# Altium project VESC_KS75600.PrjPcb
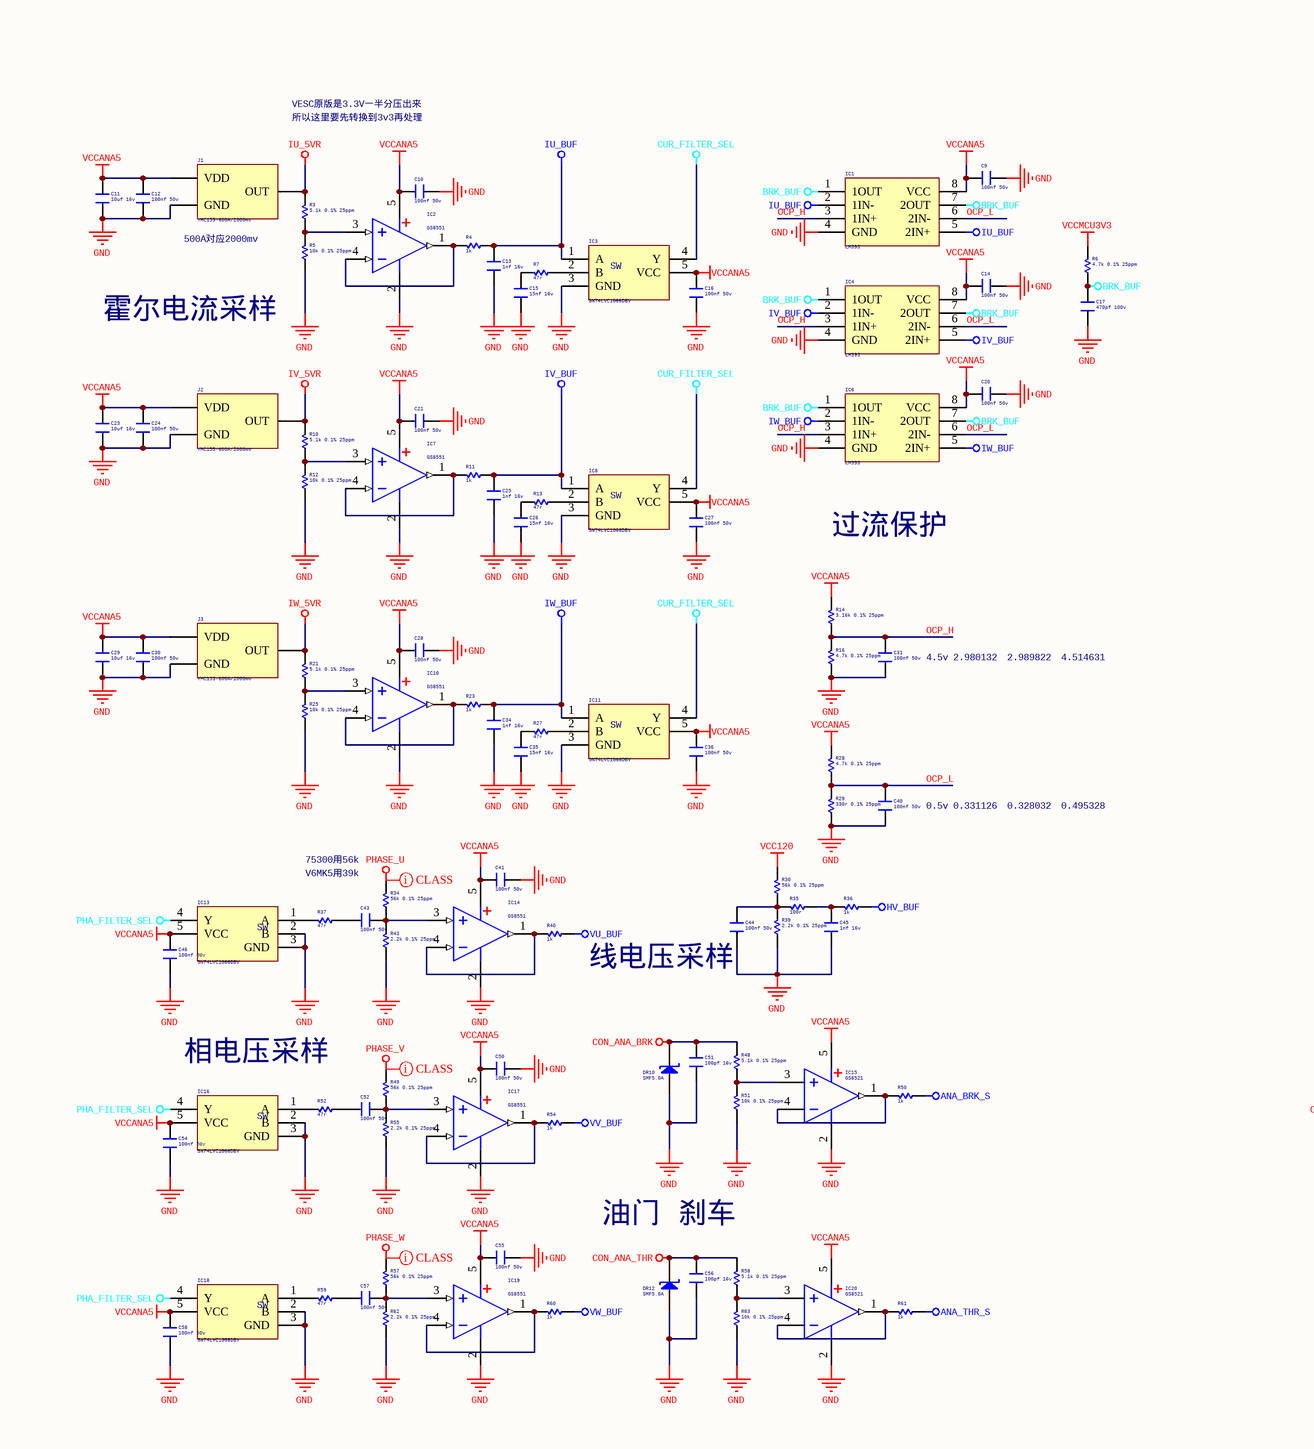
[diagram p0: VESC_KS75600_ana_con.SchDoc, left]
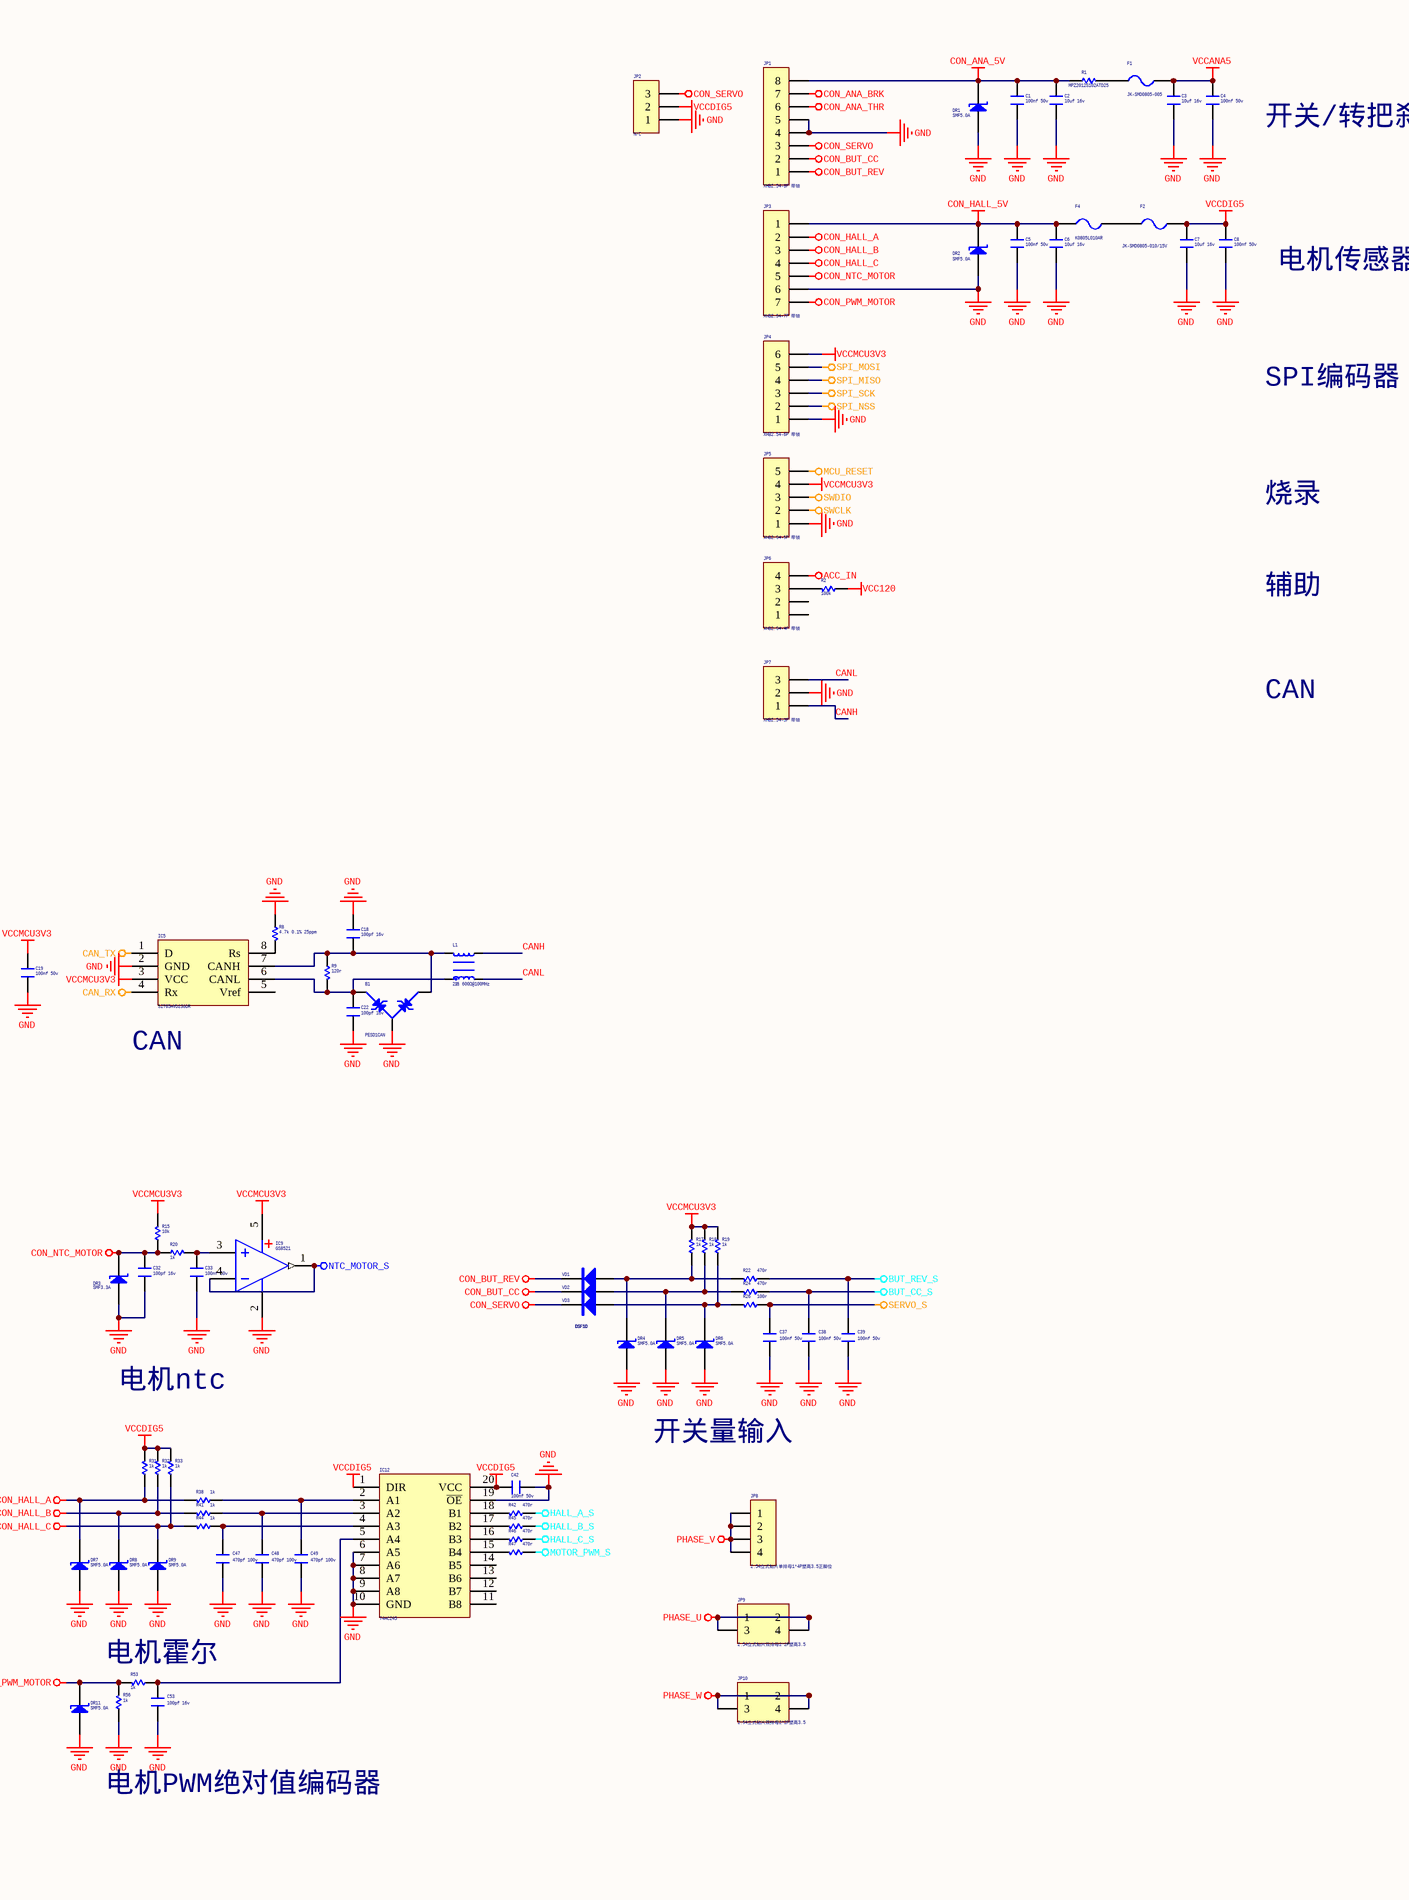
[diagram p1: VESC_KS75600_ana_con.SchDoc, right]
4 sheets, 300 parts. Net scope: global (net labels, ports and power ports of the same name join across sheets).
Board file: VESC_KS75600.PcbDoc
Sheets:
  VESC_KS75600_ana_con.SchDoc
  VESC_KS75600_power.SchDoc
  VESC_KS75600_motor_mcu.SchDoc
  VESC_KS75600_mos_driver_conn.SchDoc

## Sheet VESC_KS75600_ana_con.SchDoc
size A2; SheetNumber: 1; SheetTotal: 4

### Parts
B1  PESD1CAN  [SOT23-3L]
C1  100nf 50v  [C 0603]
C2  10uf 16v  [C 0805]
C3  10uf 16v  [C 0805]
C4  100nf 50v  [C 0603]
C5  100nf 50v  [C 0603]
C6  10uf 16v  [C 0805]
C7  10uf 16v  [C 0805]
C8  100nf 50v  [C 0603]
C9  100nf 50v  [C 0603]
C10  100nf 50v  [C 0603]
C11  10uf 16v  [C 0805]
C12  100nf 50v  [C 0603]
C13  1nf 16v  [C 0603]
C14  100nf 50v  [C 0603]
C15  15nf 16v  [C 0603]
C16  100nf 50v  [C 0603]
C17  470pf 100v  [C 0805]
C18  100pf 16v  [C 0603]
C19  100nf 50v  [C 0603]
C20  100nf 50v  [C 0603]
C21  100nf 50v  [C 0603]
C22  100pf 16v  [C 0603]
C23  10uf 16v  [C 0805]
C24  100nf 50v  [C 0603]
C25  1nf 16v  [C 0603]
C26  15nf 16v  [C 0603]
C27  100nf 50v  [C 0603]
C28  100nf 50v  [C 0603]
C29  10uf 16v  [C 0805]
C30  100nf 50v  [C 0603]
C31  100nf 50v  [C 0603]
C32  100pf 16v  [C 0603]
C33  100nf 50v  [C 0603]
C34  1nf 16v  [C 0603]
C35  15nf 16v  [C 0603]
C36  100nf 50v  [C 0603]
C37  100nf 50v  [C 0805]
C38  100nf 50v  [C 0805]
C39  100nf 50v  [C 0805]
C40  100nf 50v  [C 0603]
C41  100nf 50v  [C 0603]
C42  100nf 50v  [C 0603]
C43  100nf 50v  [C 0805]
C44  100nf 50v  [C 0805]
C45  1nf 16v  [C 0603]
C46  100nf 50v  [C 0603]
C47  470pf 100v  [C 0805]
C48  470pf 100v  [C 0805]
C49  470pf 100v  [C 0805]
C50  100nf 50v  [C 0603]
C51  100pf 16v  [C 0603]
C52  100nf 50v  [C 0805]
C53  100pf 16v  [C 0805]
C54  100nf 50v  [C 0603]
C55  100nf 50v  [C 0603]
C56  100pf 16v  [C 0603]
C57  100nf 50v  [C 0805]
C58  100nf 50v  [C 0603]
DR1  SMF5.0A  [SOD-123F]
DR2  SMF5.0A  [SOD-123F]
DR3  SMF3.3A  [SOD-123F]
DR4  SMF5.0A  [SOD-123F]
DR5  SMF5.0A  [SOD-123F]
DR6  SMF5.0A  [SOD-123F]
DR7  SMF5.0A  [SOD-123F]
DR8  SMF5.0A  [SOD-123F]
DR9  SMF5.0A  [SOD-123F]
DR10  SMF5.0A  [SOD-123F]
DR11  SMF5.0A  [SOD-123F]
DR12  SMF5.0A  [SOD-123F]
F1  JK-SMD0805-005  [FU 0805]
F2  JK-SMD0805-010/15V  [FU 0805]
F4  K0805L010AR  [FU 0805]
IC1  LM393  [SOP8_N]
IC2  GS8551  [SOT23-5L]
IC3  SN74LVC1G66DBV  [SOT23-5N]
IC4  LM393  [SOP8_N]
IC5  SIT65HVD230DR  [SOP8_N]
IC6  LM393  [SOP8_N]
IC7  GS8551  [SOT23-5L]
IC8  SN74LVC1G66DBV  [SOT23-5N]
IC9  GS8521  [SOT23-5N]
IC10  GS8551  [SOT23-5L]
IC11  SN74LVC1G66DBV  [SOT23-5N]
IC12  74HC245  [TSSOP20_N]
IC13  SN74LVC1G66DBV  [SOT23-5N]
IC14  GS8551  [SOT23-5L]
IC15  GS8521  [SOT23-5N]
IC16  SN74LVC1G66DBV  [SOT23-5N]
IC17  GS8551  [SOT23-5L]
IC18  SN74LVC1G66DBV  [SOT23-5N]
IC19  GS8551  [SOT23-5L]
IC20  GS8521  [SOT23-5N]
J1  YMC15S-600A/2000mv  [YMC15S]
J2  YMC15S-600A/2000mv  [YMC15S]
J3  YMC15S-600A/2000mv  [YMC15S]
JP1  XHB2.54-8P 带锁  [XH2.54-8P]
JP2  N/C  [HDR-1X3]
JP3  XHB2.54-7P 带锁  [XH2.54-7P]
JP4  XHB2.54-6P 带锁  [XH2.54-6P]
JP5  XHB2.54-5P 带锁  [XH2.54-5P]
JP6  XHB2.54-4P 带锁  [XH2.54-4P]
JP7  XHB2.54-3P 带锁  [XH2.54-3P]
JP8  2.54立式贴片单排母1*4P塑高3.5正脚位  [2.54立贴错位排母 4P]
JP9  2.54立式贴片双排母2*2P塑高3.5  [贴片2.54双排母 pcb开孔]
JP10  2.54立式贴片双排母2*2P塑高3.5  [贴片2.54双排母 pcb开孔]
L1  2路 600Ω@100MHz  [D_C_C_1206]
R1  MPZ2012S102ATD25  [R 0805]
R2  100k  [R 0805]
R3  5.1k 0.1% 25ppm  [R 0805-HP]
R4  1k  [R 0603]
R5  10k 0.1% 25ppm  [R 0805-HP]
R6  4.7k 0.1% 25ppm  [R 0805]
R7  47r  [R 0603]
R8  4.7k 0.1% 25ppm  [R 0805]
R9  120r  [R 0603]
R10  5.1k 0.1% 25ppm  [R 0805-HP]
R11  1k  [R 0603]
R12  10k 0.1% 25ppm  [R 0805-HP]
R13  47r  [R 0603]
R14  3.16k 0.1% 25ppm  [R 0805-HP]
R15  10k  [R 0603]
R16  4.7k 0.1% 25ppm  [R 0805]
R17  1k  [R 0603]
R18  1k  [R 0603]
R19  1k  [R 0603]
R20  1k  [R 0603]
R21  5.1k 0.1% 25ppm  [R 0805-HP]
R22  470r  [R 0603]
R23  1k  [R 0603]
R24  470r  [R 0603]
R25  10k 0.1% 25ppm  [R 0805-HP]
R26  100r  [R 0603]
R27  47r  [R 0603]
R28  4.7k 0.1% 25ppm  [R 0805]
R29  330r 0.1% 25ppm  [R 0805-HP]
R30  56k 0.1% 25ppm  [R 0805-HP]
R31  1k  [R 0603]
R32  1k  [R 0603]
R33  1k  [R 0603]
R34  56k 0.1% 25ppm  [R 0805-HP]
R35  100r  [R 0603]
R36  1k  [R 0603]
R37  47r  [R 0603]
R38  1k  [R 0603]
R39  2.2k 0.1% 25ppm  [R 0805-HP]
R40  1k  [R 0603]
R41  1k  [R 0603]
R42  470r  [R 0603]
R43  2.2k 0.1% 25ppm  [R 0805-HP]
R44  1k  [R 0603]
R45  470r  [R 0603]
R46  470r  [R 0603]
R47  470r  [R 0603]
R48  5.1k 0.1% 25ppm  [R 0805-HP]
R49  56k 0.1% 25ppm  [R 0805-HP]
R50  1k  [R 0603]
R51  10k 0.1% 25ppm  [R 0805-HP]
R52  47r  [R 0603]
R53  1k  [R 0603]
R54  1k  [R 0603]
R55  2.2k 0.1% 25ppm  [R 0805-HP]
R56  1k  [R 0603]
R57  56k 0.1% 25ppm  [R 0805-HP]
R58  5.1k 0.1% 25ppm  [R 0805-HP]
R59  47r  [R 0603]
R60  1k  [R 0603]
R61  1k  [R 0603]
R62  2.2k 0.1% 25ppm  [R 0805-HP]
R63  10k 0.1% 25ppm  [R 0805-HP]
VD1  DSF1D  [SOD-123]
VD2  DSF1D  [SOD-123]
VD3  DSF1D  [SOD-123]

### Nets
ACC_IN: JP6.4
ANA_BRK_S: R50.1
ANA_THR_S: R61.1
BRK_BUF: C17.1 IC1.1(1OUT) IC1.7(2OUT) IC4.1(1OUT) IC4.7(2OUT) IC6.1(1OUT) IC6.7(2OUT) R6.1
BUT_CC_S: C38.2 R24.1
BUT_REV_S: C39.2 R22.1
CAN_RX: IC5.4(Rx)
CAN_TX: IC5.1(D)
CON_ANA_5V: C1.1 C2.1 DR1.2(K) JP1.8 R1.1
CON_ANA_BRK: C51.2 DR10.2(K) JP1.7 R48.2
CON_ANA_THR: C56.2 DR12.2(K) JP1.6 R58.2
CON_BUT_CC: JP1.2 VD2.2(K)
CON_BUT_REV: JP1.1 VD1.2(K)
CON_HALL_5V: C5.1 C6.1 DR2.2(K) F4.2 JP3.1
CON_HALL_A: DR7.2(K) JP3.2 R31.1 R38.2
CON_HALL_B: DR8.2(K) JP3.3 R32.1 R41.2
CON_HALL_C: DR9.2(K) JP3.4 R33.1 R44.2
CON_NTC_MOTOR: C32.2 DR3.2(K) JP3.5 R15.1 R20.1
CON_PWM_MOTOR: DR11.2(K) JP3.7 R53.2 R56.2
CON_SERVO: JP1.3 JP2.3 VD3.2(K)
CUR_FILTER_SEL: IC3.4(Y) IC8.4(Y) IC11.4(Y)
GND: B1.3 C1.2 C2.2 C3.2 C4.2 C5.2 C6.2 C7.2 C8.2 C9.2 C10.2 C11.1 C12.2 C13.2 C14.2 C15.2 C16.2 C17.2 C18.2 C19.2 C20.2 C21.2 C22.1 C23.1 C24.2 C25.2 C26.2 C27.2 C28.2 C29.1 C30.2 C31.1 C32.1 C33.1 C34.2 C35.2 C36.2 C37.1 C38.1 C39.1 C40.1 C41.2 C42.2 C44.2 C45.2 C46.2 C47.1 C48.1 C49.1 C50.2 C51.1 C53.1 C54.2 C55.2 C56.1 C58.2 DR1.1(A) DR2.1(A) DR3.1(A) DR4.1(A) DR5.1(A) DR6.1(A) DR7.1(A) DR8.1(A) DR9.1(A) DR10.1(A) DR11.1(A) DR12.1(A) IC1.4(GND) IC2.2(V-) IC3.3(GND) IC4.4(GND) IC5.2(GND) IC6.4(GND) IC7.2(V-) IC8.3(GND) IC9.2(V-) IC10.2(V-) IC11.3(GND) IC12.6(A5) IC12.7(A6) IC12.8(A7) IC12.9(A8) IC12.10(GND) IC12.19(~{OE}) IC13.2(B) IC13.3(GND) IC14.2(V-) IC15.2(V-) IC16.2(B) IC16.3(GND) IC17.2(V-) IC18.2(B) IC18.3(GND) IC19.2(V-) IC20.2(V-) J1.2(GND) J2.2(GND) J3.2(GND) JP1.4 JP1.5 JP2.1 JP3.6 JP4.1 JP5.1 JP7.2 R5.1 R8.1 R12.1 R16.1 R25.1 R29.1 R39.1 R43.1 R51.1 R55.1 R56.1 R62.1 R63.1
HALL_A_S: R42.1
HALL_B_S: R45.1
HALL_C_S: R46.1
HV_BUF: R36.1
IU_5VR: J1.3(OUT) R3.2
IU_BUF: C13.1 IC1.2(1IN-) IC1.5(2IN+) IC3.1(A) R4.1
IV_5VR: J2.3(OUT) R10.2
IV_BUF: C25.1 IC4.2(1IN-) IC4.5(2IN+) IC8.1(A) R11.1
IW_5VR: J3.3(OUT) R21.2
IW_BUF: C34.1 IC6.2(1IN-) IC6.5(2IN+) IC11.1(A) R23.1
MCU_RESET: JP5.5
MOTOR_PWM_S: R47.1
NTC_MOTOR_S: IC9.1(OUT) IC9.4(IN-)
PHA_FILTER_SEL: IC13.4(Y) IC16.4(Y) IC18.4(Y)
PHASE_U: JP9.1 JP9.2 JP9.3 JP9.4 R34.2
PHASE_V: JP8.1 JP8.2 JP8.3 JP8.4 R49.2
PHASE_W: JP10.1 JP10.2 JP10.3 JP10.4 R57.2
SERVO_S: C37.2 R26.1
SPI_MISO: JP4.4
SPI_MOSI: JP4.5
SPI_NSS: JP4.2
SPI_SCK: JP4.3
SWCLK: JP5.2
SWDIO: JP5.3
VCC120: R2.1 R30.2
VCCANA5: C3.1 C4.1 C9.1 C10.1 C11.2 C12.1 C14.1 C16.1 C20.1 C21.1 C23.2 C24.1 C27.1 C28.1 C29.2 C30.1 C36.1 C41.1 C46.1 C50.1 C54.1 C55.1 C58.1 F1.1 IC1.8(VCC) IC2.5(V+) IC3.5(VCC) IC4.8(VCC) IC6.8(VCC) IC7.5(V+) IC8.5(VCC) IC10.5(V+) IC11.5(VCC) IC13.5(VCC) IC14.5(V+) IC15.5(V+) IC16.5(VCC) IC17.5(V+) IC18.5(VCC) IC19.5(V+) IC20.5(V+) J1.1(VDD) J2.1(VDD) J3.1(VDD) R14.2 R28.2
VCCDIG5: C7.1 C8.1 C42.1 F2.1 IC12.1(DIR) IC12.20(VCC) JP2.2 R31.2 R32.2 R33.2
VCCMCU3V3: C19.1 IC5.3(VCC) IC9.5(V+) JP4.6 JP5.4 R6.2 R15.2 R17.2 R18.2 R19.2
VU_BUF: R40.1
VV_BUF: R54.1
VW_BUF: R60.1
CANH: JP7.1 L1.3
CANL: JP7.3 L1.2
OCP_H: C31.2 IC1.3(1IN+) IC4.3(1IN+) IC6.3(1IN+) R14.1 R16.2
OCP_L: C40.2 IC1.6(2IN-) IC4.6(2IN-) IC6.6(2IN-) R28.1 R29.2
NetB1_1: B1.1 C18.1 IC5.7(CANH) L1.4 R9.1
NetB1_2: B1.2 C22.2 IC5.6(CANL) L1.1 R9.2
NetC15_1: C15.1 R7.2
NetC26_1: C26.1 R13.2
NetC33_2: C33.2 IC9.3(IN+) R20.2
NetC35_1: C35.1 R27.2
NetC43_1: C43.1 R37.1
NetC43_2: C43.2 IC14.3(IN+) R34.1 R43.2
NetC44_1: C44.1 R30.1 R35.2 R39.2
NetC45_1: C45.1 R35.1 R36.2
NetC47_2: C47.2 IC12.4(A3) R44.1
NetC48_2: C48.2 IC12.3(A2) R41.1
NetC49_2: C49.2 IC12.2(A1) R38.1
NetC52_1: C52.1 R52.1
NetC52_2: C52.2 IC17.3(IN+) R49.1 R55.2
NetC53_2: C53.2 IC12.5(A4) R53.1
NetC57_1: C57.1 R59.1
NetC57_2: C57.2 IC19.3(IN+) R57.1 R62.2
NetDR4_2: DR4.2(K) R17.1 R22.2 VD1.1(A)
NetDR5_2: DR5.2(K) R18.1 R24.2 VD2.1(A)
NetDR6_2: DR6.2(K) R19.1 R26.2 VD3.1(A)
NetF1_2: F1.2 R1.2
NetF2_2: F2.2 F4.1
NetIC2_1: IC2.1(OUT) IC2.4(IN-) R4.2
NetIC2_3: IC2.3(IN+) R3.1 R5.2
NetIC3_2: IC3.2(B) R7.1
NetIC5_8: IC5.8(Rs) R8.2
NetIC7_1: IC7.1(OUT) IC7.4(IN-) R11.2
NetIC7_3: IC7.3(IN+) R10.1 R12.2
NetIC8_2: IC8.2(B) R13.1
NetIC10_1: IC10.1(OUT) IC10.4(IN-) R23.2
NetIC10_3: IC10.3(IN+) R21.1 R25.2
NetIC11_2: IC11.2(B) R27.1
NetIC12_15: IC12.15(B4) R47.2
NetIC12_16: IC12.16(B3) R46.2
NetIC12_17: IC12.17(B2) R45.2
NetIC12_18: IC12.18(B1) R42.2
NetIC13_1: IC13.1(A) R37.2
NetIC14_1: IC14.1(OUT) IC14.4(IN-) R40.2
NetIC15_1: IC15.1(OUT) IC15.4(IN-) R50.2
NetIC15_3: IC15.3(IN+) R48.1 R51.2
NetIC16_1: IC16.1(A) R52.2
NetIC17_1: IC17.1(OUT) IC17.4(IN-) R54.2
NetIC18_1: IC18.1(A) R59.2
NetIC19_1: IC19.1(OUT) IC19.4(IN-) R60.2
NetIC20_1: IC20.1(OUT) IC20.4(IN-) R61.2
NetIC20_3: IC20.3(IN+) R58.1 R63.2
NetJP6_3: JP6.3 R2.2

Not connected (* = marked no-connect by the designer): IC5 5(Vref); IC12 11(B8) 12(B7) 13(B6) 14(B5); JP6 1 2

### Layout directives
net class 相线: PHASE_U, PHASE_V, PHASE_W

### Notes on the sheet
- 开关/转把刹车
- 电机传感器
- SPI编码器
- 烧录
- 辅助
- VESC原版是3.3V一半分压出来
- 所以这里要先转换到3v3再处理
- CAN
- (near J1) 500A对应2000mv
- 霍尔电流采样
- (near IC5) CAN
- 过流保护
- (near C31) 4.5v
- 2.980132
- 2.989822
- 4.514631
- (near C40) 0.5v
- 0.331126
- 0.328032
- 0.495328
- 电机ntc
- 75300用56k
- V6MK5用39k
- 开关量输入
- (near R40) 线电压采样
- (near IC16) 相电压采样
- (near R53) 电机霍尔
- 油门 刹车
- 电机PWM绝对值编码器
- (in symbol SN74LVC1G66) SW

### Library data of the parts
B1 = SM712: 7V+12V 双向双路TVS
C1-C58 = C: 无极性贴片电容
  C1 C4 C5 C8-C10 C12 C14 C16 C19-C21 C24 C27 C28 C30 C31 C33 C36-C44 C46 C50 C52 C54 C55 C57 C58: Voltage: 50v; Value: 100nf
  C2 C3 C6 C7 C11 C23 C29: Voltage: 16v; Value: 10uf
  C13 C25 C34 C45: Voltage: 16v; Value: 1nf
  C15 C26 C35: Voltage: 16v; Value: 15nf
  C17 C47-C49: Voltage: 100v; Value: 470pf
  C18 C22 C32 C51 C53 C56: Voltage: 16v; Value: 100pf
DR1-DR12 = DR_S: 瞬态电压抑制二极管(单向)
F1 F2 F4 = FU: 贴片保险丝
IC1 IC4 IC6 = LM393_A: 双路电压比较
IC2 IC7 IC9 IC10 IC14 IC15 IC17 IC19 IC20 = GS8331: 单运放 SOT23-5
IC3 IC8 IC11 IC13 IC16 IC18 = SN74LVC1G66: 单路常开模拟开关 0.5ns 5.5Ω
IC5 = SN65HVD230: CAN芯片
IC12 = 74HC245: 八线收发器
J1-J3 = YMC15S: 源弥科技 开环霍尔传感器
JP1 = Header 8: 8P接插件
JP2 JP7 = Header 3: 3P接插件
JP3 = Header 7: 7P接插件
JP4 = Header 6: 6P接插件
JP5 = Header 5: 5P接插件
JP6 JP8 = Header 4: 4P接插件
JP9 JP10 = Header 2X2: 2*2P接插件
L1 = L-CMC: 共模电感; Value: 2路 600Ω@100MHz
R1-R63 = R: 贴片电阻
  R1: Value: MPZ2012S102ATD25
  R2: Value: 100k
  R3 R10 R21 R48 R58: Value: 5.1k 0.1% 25ppm
  R4 R11 R17-R20 R23 R31-R33 R36 R38 R40 R41 R44 R50 R53 R54 R56 R60 R61: Value: 1k
  R5 R12 R25 R51 R63: Value: 10k 0.1% 25ppm
  R6 R8 R16 R28: Value: 4.7k 0.1% 25ppm
  R7 R13 R27 R37 R52 R59: Value: 47r
  R9: Value: 120r
  R14: Value: 3.16k 0.1% 25ppm
  R15: Value: 10k
  R22 R24 R42 R45-R47: Value: 470r
  R26 R35: Value: 100r
  R29: Value: 330r 0.1% 25ppm
  R30 R34 R49 R57: Value: 56k 0.1% 25ppm
  R39 R43 R55 R62: Value: 2.2k 0.1% 25ppm
VD1-VD3 = SR540: 肖特基二极管

## Sheet VESC_KS75600_power.SchDoc
size A3; SheetNumber: 2; SheetTotal: 4
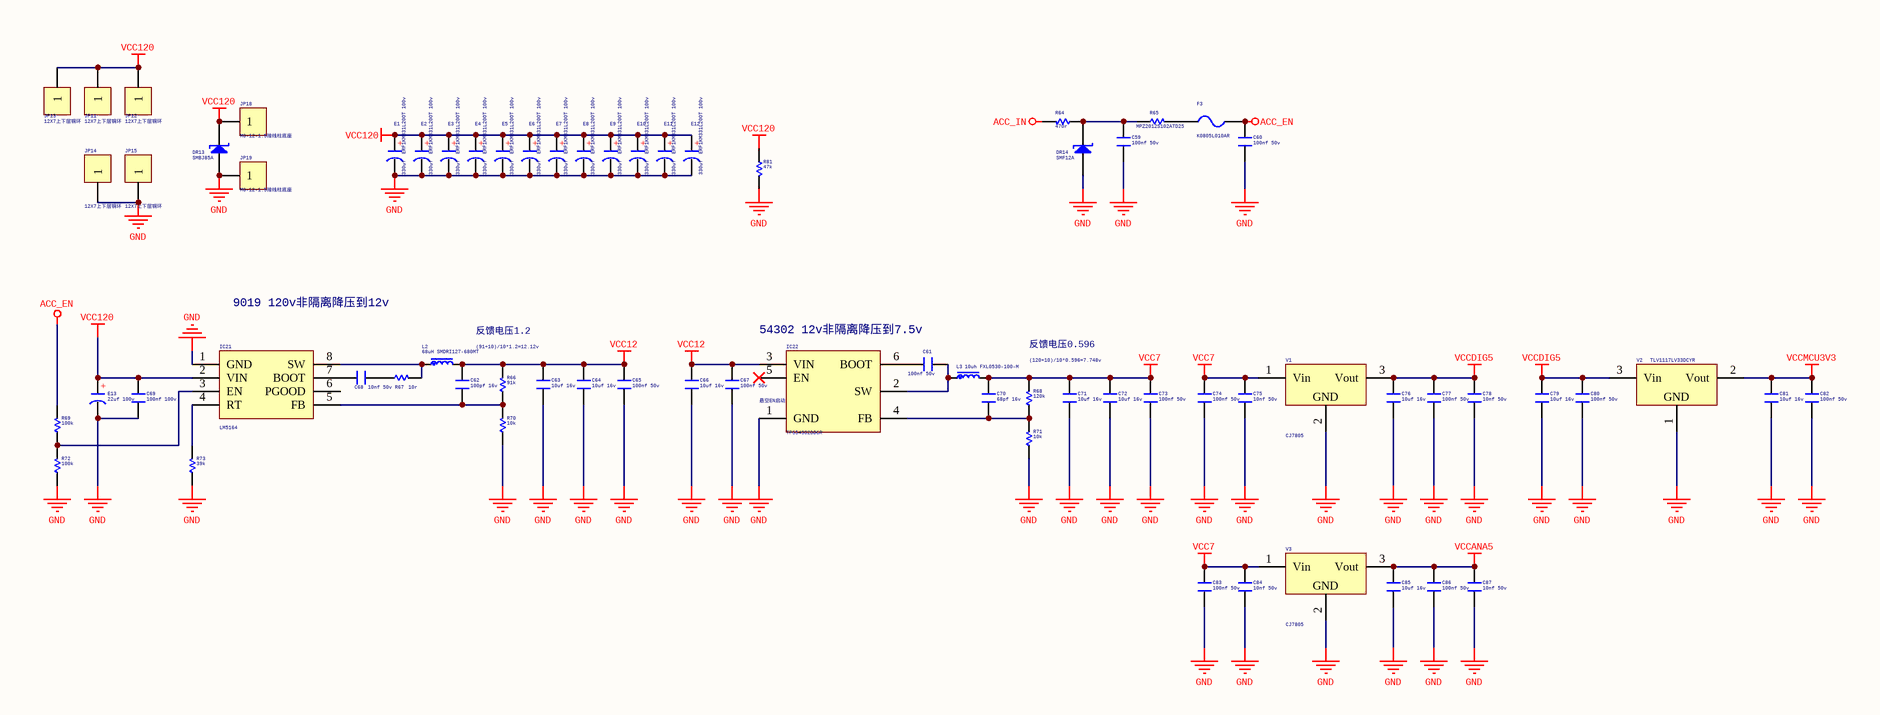
[diagram p2: VESC_KS75600_power.SchDoc]

### Parts
C59  100nf 50v  [C 0805]
C60  100nf 50v  [C 0805]
C61  100nf 50v  [C 0805]
C62  100pf 16v  [C 0603]
C63  10uf 16v  [C 0805]
C64  10uf 16v  [C 0805]
C65  100nf 50v  [C 0805]
C66  10uf 16v  [C 0805]
C67  100nf 50v  [C 0805]
C68  10nf 50v  [C 0603]
C69  100nf 100v  [C 1206]
C70  68pf 16v  [C 0603]
C71  10uf 16v  [C 0805]
C72  10uf 16v  [C 0805]
C73  100nf 50v  [C 0805]
C74  100nf 50v  [C 0603]
C75  10nf 50v  [C 0603]
C76  10uf 16v  [C 0805]
C77  100nf 50v  [C 0603]
C78  10nf 50v  [C 0603]
C79  10uf 16v  [C 0805]
C80  100nf 50v  [C 0603]
C81  10uf 16v  [C 0805]
C82  100nf 50v  [C 0603]
C83  100nf 50v  [C 0603]
C84  10nf 50v  [C 0603]
C85  10uf 16v  [C 0805]
C86  100nf 50v  [C 0603]
C87  10nf 50v  [C 0603]
DR13  SMBJ85A  [SMB]
DR14  SMF12A  [SOD-123F]
E1  330uf  ERF1KM331L20OT 100v  [CAP 7.5*16*25 - GD]
E2  330uf  ERF1KM331L20OT 100v  [CAP 7.5*16*25 - GD]
E3  330uf  ERF1KM331L20OT 100v  [CAP 7.5*16*25 - GD]
E4  330uf  ERF1KM331L20OT 100v  [CAP 7.5*16*25 - GD]
E5  330uf  ERF1KM331L20OT 100v  [CAP 7.5*16*25 - GD]
E6  330uf  ERF1KM331L20OT 100v  [CAP 7.5*16*25 - GD]
E7  330uf  ERF1KM331L20OT 100v  [CAP 7.5*16*25 - GD]
E8  330uf  ERF1KM331L20OT 100v  [CAP 7.5*16*25 - GD]
E9  330uf  ERF1KM331L20OT 100v  [CAP 7.5*16*25 - GD]
E10  330uf  ERF1KM331L20OT 100v  [CAP 7.5*16*25 - GD]
E11  330uf  ERF1KM331L20OT 100v  [CAP 7.5*16*25 - GD]
E12  330uf  ERF1KM331L20OT 100v  [CAP 7.5*16*25 - GD]
E13  22uf 100v  [CAP 2.5*6.3*11.2 - BK]
F3  K0805L010AR  [FU 0805]
IC21  LM5164  [SOP8_EPAD_L]
IC22  TPS54302DDCR  [SOT23-6L]
JP11  12X7上下层铜环  [11x6.5上下层铜环]
JP12  12X7上下层铜环  [11x6.5上下层铜环]
JP13  12X7上下层铜环  [11x6.5上下层铜环]
JP14  12X7上下层铜环  [11x6.5上下层铜环]
JP15  12X7上下层铜环  [11x6.5上下层铜环]
JP18  M6-12-1.5接线柱底座  [接线柱底座焊盘]
JP19  M6-12-1.5接线柱底座  [接线柱底座焊盘]
L2  68uH SMDRI127-680MT  [CDRH127]
L3  10uh FXL0530-100-M  [L-SMD-0530]
R64  470r  [R 1206]
R65  MPZ2012S102ATD25  [R 0805]
R66  91k  [R 0603]
R67  10r  [R 1206-HP]
R68  120k  [R 0603]
R69  100k  [R 0805]
R70  10k  [R 0603]
R71  10k  [R 0603]
R72  100k  [R 0805]
R73  39k  [R 0805]
R81  47k  [R 2512]
V1  CJ7805  [TO252]
V2  TLV1117LV33DCYR  [SOT223_L]
V3  CJ7805  [TO252]

### Nets
ACC_EN: C60.1 F3.1 R69.2
ACC_IN: R64.2
GND: C59.2 C60.2 C63.2 C64.2 C65.2 C66.2 C67.2 C69.1 C71.2 C72.2 C73.2 C74.2 C75.2 C76.1 C77.2 C78.2 C79.2 C80.2 C81.2 C82.2 C83.2 C84.2 C85.1 C86.2 C87.2 DR13.1(A) DR14.1(A) E1.2 E2.2 E3.2 E4.2 E5.2 E6.2 E7.2 E8.2 E9.2 E10.2 E11.2 E12.2 E13.2 IC21.1(GND) IC22.1(GND) JP14.1 JP15.1 JP19.1 R70.1 R71.1 R72.1 R73.1 R81.2 V1.2(GND) V2.1(GND) V3.2(GND)
VCC7: C70.1 C71.1 C72.1 C73.1 C74.1 C75.1 C83.1 C84.1 L3.2 R68.2 V1.1(Vin) V3.1(Vin)
VCC12: C62.1 C63.1 C64.1 C65.1 C66.1 C67.1 IC22.3(VIN) L2.2 R66.2
VCC120: C69.2 DR13.2(K) E1.1 E2.1 E3.1 E4.1 E5.1 E6.1 E7.1 E8.1 E9.1 E10.1 E11.1 E12.1 E13.1 IC21.2(VIN) JP11.1 JP12.1 JP13.1 JP18.1 R81.1
VCCANA5: C85.2 C86.1 C87.1 V3.3(Vout)
VCCDIG5: C76.2 C77.1 C78.1 C79.1 C80.1 V1.3(Vout) V2.3(Vin)
VCCMCU3V3: C81.1 C82.1 V2.2(Vout)
NetC59_1: C59.1 DR14.2(K) R64.1 R65.1
NetC61_1: C61.1 IC22.6(BOOT)
NetC61_2: C61.2 IC22.2(SW) L3.1
NetC62_2: C62.2 IC21.5(FB) R66.1 R70.2
NetC68_1: C68.1 R67.1
NetC68_2: C68.2 IC21.7(BOOT)
NetC70_2: C70.2 IC22.4(FB) R68.1 R71.2
NetF3_2: F3.2 R65.2
NetIC21_3: IC21.3(EN) R69.1 R72.2
NetIC21_4: IC21.4(RT) R73.2
NetIC21_8: IC21.8(SW) L2.1 R67.2

Not connected (* = marked no-connect by the designer): IC21 6(PGOOD); IC22 5(EN)*

### Notes on the sheet
- 9019 120v非隔离降压到12v
- (91+10)/10*1.2=12.12v
- 反馈电压1.2
- (near IC22) 54302 12v非隔离降压到7.5v
- (120+10)/10*0.596=7.748v
- 反馈电压0.596
- (near IC22) 悬空EN启动
- (in symbol C-CAP) +

### Library data of the parts
C59-C87 = C: 无极性贴片电容
  C59-C61 C65 C67 C73 C74 C77 C80 C82 C83 C86: Voltage: 50v; Value: 100nf
  C62: Voltage: 16v; Value: 100pf
  C63 C64 C66 C71 C72 C76 C79 C81 C85: Voltage: 16v; Value: 10uf
  C68 C75 C78 C84 C87: Voltage: 50v; Value: 10nf
  C69: Voltage: 100v; Value: 100nf
  C70: Voltage: 16v; Value: 68pf
DR13 DR14 = DR_S: 瞬态电压抑制二极管(单向)
E1-E13 = C-CAP: 直插电解电容; Voltage: 100v
  E1-E12: Value: 330uf  ERF1KM331L20OT
  E13: Value: 22uf
F3 = FU: 贴片保险丝
IC21 = MK9019: 100V 1Mhz BUCK控制器
IC22 = TPS54302: 4.5V 至 28V 输入、3A 输出、EMI 友好型同步降压转换器
JP11-JP15 JP18 JP19 = Header 1: 1P接插件
L2 = L-CDRH: 功率屏蔽电感; Value: 68uH SMDRI127-680MT
L3 = L-SMD: 贴片一体成形功率电感; Value: 10uh FXL0530-100-M
R64-R73 R81 = R: 贴片电阻
  R64: Value: 470r
  R65: Value: MPZ2012S102ATD25
  R66: Value: 91k
  R67: Value: 10r
  R68: Value: 120k
  R69 R72: Value: 100k
  R70 R71: Value: 10k
  R73: Value: 39k
  R81: Value: 47k
V1 V3 = 78xx: 线性稳压芯片
V2 = AMS1117: 三端稳压芯片

## Sheet VESC_KS75600_motor_mcu.SchDoc
size A3; SheetNumber: 3; SheetTotal: 4
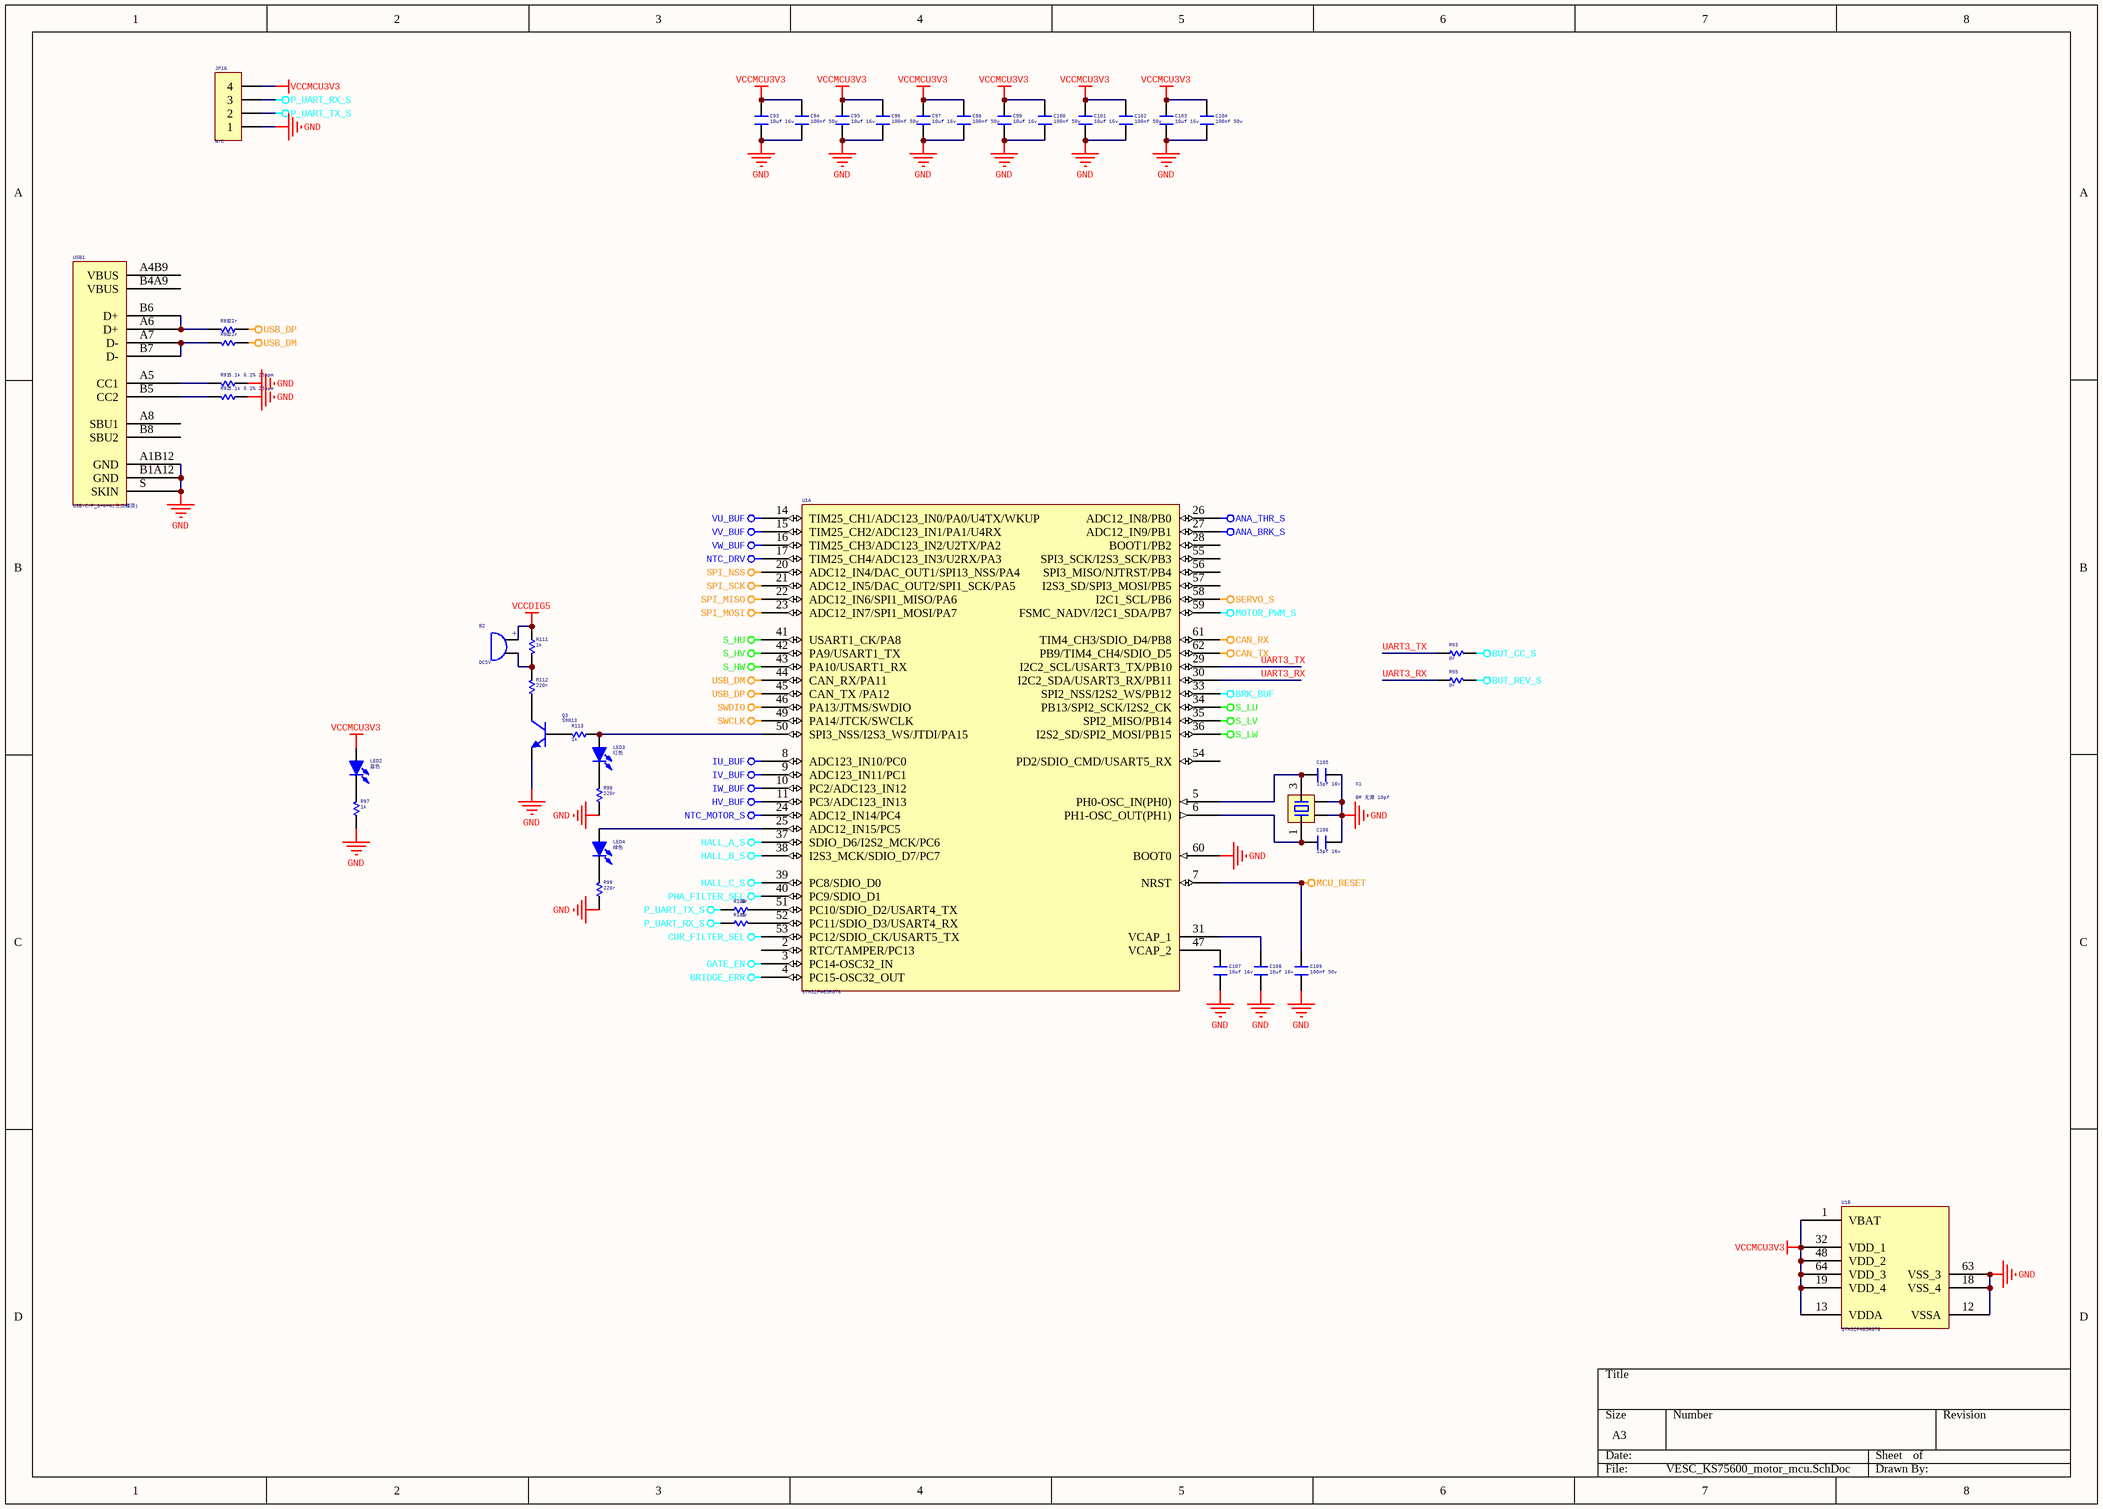
[diagram p3: VESC_KS75600_motor_mcu.SchDoc]

### Parts
B2  DC5V  [BEEP 5x9x5.5]
C93  10uf 16v  [C 0805]
C94  100nf 50v  [C 0603]
C95  10uf 16v  [C 0805]
C96  100nf 50v  [C 0603]
C97  10uf 16v  [C 0805]
C98  100nf 50v  [C 0603]
C99  10uf 16v  [C 0805]
C100  100nf 50v  [C 0603]
C101  10uf 16v  [C 0805]
C102  100nf 50v  [C 0603]
C103  10uf 16v  [C 0805]
C104  100nf 50v  [C 0603]
C105  15pf 16v  [C 0603]
C106  15pf 16v  [C 0603]
C107  10uf 16v  [C 0805]
C108  10uf 16v  [C 0805]
C109  100nf 50v  [C 0603]
JP16  N/C  [HDR-1X4]
LED2  蓝色  [LED 0603G]
LED3  红色  [LED 0603G]
LED4  绿色  [LED 0603G]
Q3  S9013  [SOT23-3N]
R89  22r  [R 0603]
R90  22r  [R 0603]
R91  5.1k 0.1% 25ppm  [R 0805-HP]
R92  5.1k 0.1% 25ppm  [R 0805-HP]
R93  0r  [R 0603]
R95  0r  [R 0603]
R97  1k  [R 0603]
R98  220r  [R 0603]
R99  220r  [R 0603]
R100  0r  [R 0603]
R101  0r  [R 0603]
R111  1k  [R 0603]
R112  220r  [R 0603]
R113  1k  [R 0603]
U1  STM32F405RGT6  [LQFP64 10x10_L]  (parts A,B of 2)
USB1  USB-C/P_8+4+4(三次模顶)  [USB-C/S_16_0D_F]
X1  8M 无源 10pf  [XTAL-3225]

### Nets
ANA_BRK_S: U1.27(ADC12_IN9/PB1)
ANA_THR_S: U1.26(ADC12_IN8/PB0)
BRIDGE_ERR: U1.4(PC15-OSC32_OUT)
BRK_BUF: U1.33(SPI2_NSS/I2S2_WS/PB12)
BUT_CC_S: R93.2
BUT_REV_S: R95.2
CAN_RX: U1.61(TIM4_CH3/SDIO_D4/PB8)
CAN_TX: U1.62(PB9/TIM4_CH4/SDIO_D5)
CUR_FILTER_SEL: U1.53(PC12/SDIO_CK/USART5_TX)
GATE_EN: U1.3(PC14-OSC32_IN)
GND: C93.2 C94.2 C95.2 C96.2 C97.2 C98.2 C99.2 C100.2 C101.2 C102.2 C103.2 C104.2 C105.1 C106.1 C107.2 C108.2 C109.1 JP16.1 Q3.2(E) R91.1 R92.1 R97.1 R98.1 R99.1 U1.12(VSSA) U1.18(VSS_4) U1.60(BOOT0) U1.63(VSS_3) USB1.A1B12(GND) USB1.B1A12(GND) USB1.S(SKIN) X1.2 X1.4
HALL_A_S: U1.37(SDIO_D6/I2S2_MCK/PC6)
HALL_B_S: U1.38(I2S3_MCK/SDIO_D7/PC7)
HALL_C_S: U1.39(PC8/SDIO_D0)
HV_BUF: U1.11(PC3/ADC123_IN13)
IU_BUF: U1.8(ADC123_IN10/PC0)
IV_BUF: U1.9(ADC123_IN11/PC1)
IW_BUF: U1.10(PC2/ADC123_IN12)
MCU_RESET: C109.2 U1.7(NRST)
MOTOR_PWM_S: U1.59(FSMC_NADV/I2C1_SDA/PB7)
NTC_DRV: U1.17(TIM25_CH4/ADC123_IN3/U2RX/PA3)
NTC_MOTOR_S: U1.24(ADC12_IN14/PC4)
P_UART_RX_S: JP16.3 R101.1
P_UART_TX_S: JP16.2 R100.1
PHA_FILTER_SEL: U1.40(PC9/SDIO_D1)
S_HU: U1.41(USART1_CK/PA8)
S_HV: U1.42(PA9/USART1_TX)
S_HW: U1.43(PA10/USART1_RX)
S_LU: U1.34(PB13/SPI2_SCK/I2S2_CK)
S_LV: U1.35(SPI2_MISO/PB14)
S_LW: U1.36(I2S2_SD/SPI2_MOSI/PB15)
SERVO_S: U1.58(I2C1_SCL/PB6)
SPI_MISO: U1.22(ADC12_IN6/SPI1_MISO/PA6)
SPI_MOSI: U1.23(ADC12_IN7/SPI1_MOSI/PA7)
SPI_NSS: U1.20(ADC12_IN4/DAC_OUT1/SPI13_NSS/PA4)
SPI_SCK: U1.21(ADC12_IN5/DAC_OUT2/SPI1_SCK/PA5)
SWCLK: U1.49(PA14/JTCK/SWCLK)
SWDIO: U1.46(PA13/JTMS/SWDIO)
USB_DM: R90.1 U1.44(CAN_RX/PA11)
USB_DP: R89.1 U1.45(CAN_TX_/PA12)
VCCDIG5: B2.1 R111.1
VCCMCU3V3: C93.1 C94.1 C95.1 C96.1 C97.1 C98.1 C99.1 C100.1 C101.1 C102.1 C103.1 C104.1 JP16.4 LED2.1(A) U1.1(VBAT) U1.13(VDDA) U1.19(VDD_4) U1.32(VDD_1) U1.48(VDD_2) U1.64(VDD_3)
VU_BUF: U1.14(TIM25_CH1/ADC123_IN0/PA0/U4TX/WKUP)
VV_BUF: U1.15(TIM25_CH2/ADC123_IN1/PA1/U4RX)
VW_BUF: U1.16(TIM25_CH3/ADC123_IN2/U2TX/PA2)
UART3_RX: R95.1 U1.30(I2C2_SDA/USART3_RX/PB11)
UART3_TX: R93.1 U1.29(I2C2_SCL/USART3_TX/PB10)
NetB2_2: B2.2 R111.2 R112.2
NetC105_2: C105.2 U1.5(PH0-OSC_IN(PH0)) X1.3
NetC106_2: C106.2 U1.6(PH1-OSC_OUT(PH1)) X1.1
NetC107_1: C107.1 U1.47(VCAP_2)
NetC108_1: C108.1 U1.31(VCAP_1)
NetLED2_2: LED2.2(K) R97.2
NetLED3_1: LED3.1(A) R113.1 U1.50(SPI3_NSS/I2S3_WS/JTDI/PA15)
NetLED3_2: LED3.2(K) R98.2
NetLED4_1: LED4.1(A) U1.25(ADC12_IN15/PC5)
NetLED4_2: LED4.2(K) R99.2
NetQ3_1: Q3.1(B) R113.2
NetQ3_3: Q3.3(C) R112.1
NetR89_2: R89.2 USB1.A6(D+) USB1.B6(D+)
NetR90_2: R90.2 USB1.A7(D-) USB1.B7(D-)
NetR91_2: R91.2 USB1.A5(CC1)
NetR92_2: R92.2 USB1.B5(CC2)
NetR100_2: R100.2 U1.51(PC10/SDIO_D2/USART4_TX)
NetR101_2: R101.2 U1.52(PC11/SDIO_D3/USART4_RX)

Not connected (* = marked no-connect by the designer): U1 2(RTC/TAMPER/PC13) 28(BOOT1/PB2) 54(PD2/SDIO_CMD/USART5_RX) 55(SPI3_SCK/I2S3_SCK/PB3) 56(SPI3_MISO/NJTRST/PB4) 57(I2S3_SD/SPI3_MOSI/PB5); USB1 A4B9(VBUS) A8(SBU1) B4A9(VBUS) B8(SBU2)

### Notes on the sheet
- (in symbol BEEP) +

### Library data of the parts
B2 = BEEP: 蜂鸣器
C93-C109 = C: 无极性贴片电容
  C93 C95 C97 C99 C101 C103 C107 C108: Voltage: 16v; Value: 10uf
  C94 C96 C98 C100 C102 C104 C109: Voltage: 50v; Value: 100nf
  C105 C106: Voltage: 16v; Value: 15pf
JP16 = Header 4: 4P接插件
LED2-LED4 = LED-SMD: 贴片LED
Q3 = 9013-SMD: 低频放大-NPN型
R89-R93 R95 R97-R101 R111-R113 = R: 贴片电阻
  R89 R90: Value: 22r
  R91 R92: Value: 5.1k 0.1% 25ppm
  R93 R95 R100 R101: Value: 0r
  R97 R111 R113: Value: 1k
  R98 R99 R112: Value: 220r
U1 = STM32F405RG: Flash:1024/RAM:192/IO:51
USB1 = USB-C/P_8+4+4: USB-C型贴片母接口 8（8线）+4 (电源) + 4（外壳）（2.0基础数据+CC+SBU）
X1 = XTAL-4: 4脚晶振

## Sheet VESC_KS75600_mos_driver_conn.SchDoc
size A3; SheetNumber: 4; SheetTotal: 4
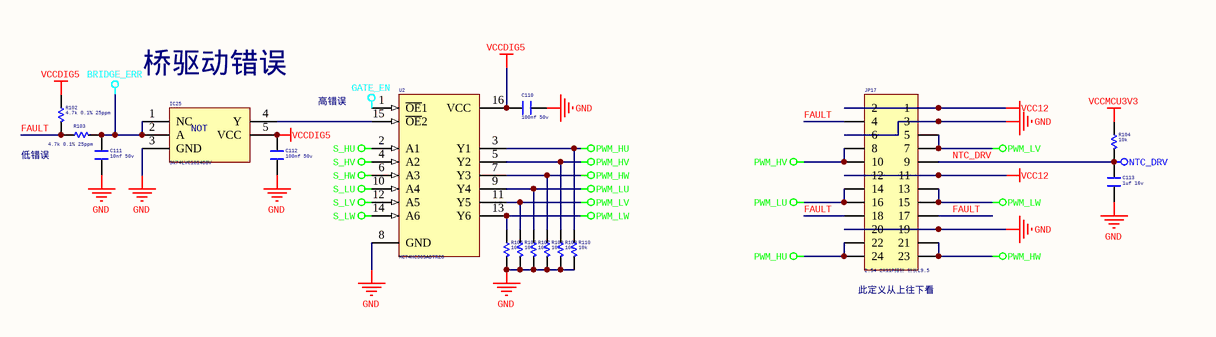
[diagram p4: VESC_KS75600_mos_driver_conn.SchDoc]

### Parts
C110  100nf 50v  [C 0603]
C111  10nf 50v  [C 0603]
C112  100nf 50v  [C 0603]
C113  1uf 16v  [C 0603]
IC25  SN74LVC1G14DBV  [SOT23-5N]
JP17  2.54 2X11P排针 针长L9.5  [HDR-12X2]
R102  4.7k 0.1% 25ppm  [R 0805]
R103  4.7k 0.1% 25ppm  [R 0805]
R104  10k  [R 0603]
R105  10k  [R 0805]
R106  10k  [R 0805]
R107  10k  [R 0805]
R108  10k  [R 0805]
R109  10k  [R 0805]
R110  10k  [R 0805]
U2  MC74HC365ADTR2G  [TSSOP16_L]

### Nets
BRIDGE_ERR: C111.1 IC25.1(NC) IC25.2(A) R103.2
GATE_EN: U2.1(~{OE}1)
GND: C110.2 C111.2 C112.1 C113.1 IC25.3(GND) JP17.3 JP17.6 JP17.19 JP17.20 R105.2 R106.2 R107.2 R108.2 R109.2 R110.2 U2.8(GND)
NTC_DRV: C113.2 JP17.9 R104.2
PWM_HU: JP17.22 JP17.24 R110.1 U2.3(Y1)
PWM_HV: JP17.8 JP17.10 R109.1 U2.5(Y2)
PWM_HW: JP17.21 JP17.23 R108.1 U2.7(Y3)
PWM_LU: JP17.14 JP17.16 R107.1 U2.9(Y4)
PWM_LV: JP17.5 JP17.7 R106.1 U2.11(Y5)
PWM_LW: JP17.13 JP17.15 R105.1 U2.13(Y6)
S_HU: U2.2(A1)
S_HV: U2.4(A2)
S_HW: U2.6(A3)
S_LU: U2.10(A4)
S_LV: U2.12(A5)
S_LW: U2.14(A6)
VCC12: JP17.1 JP17.2 JP17.11 JP17.12
VCCDIG5: C110.1 C112.2 IC25.5(VCC) R102.1 U2.16(VCC)
VCCMCU3V3: R104.1
FAULT: JP17.4 JP17.17 JP17.18 R102.2 R103.1
NetIC25_4: IC25.4(Y) U2.15(~{OE}2)

### Notes on the sheet
- (near IC25) 桥驱动错误
- 高错误
- 低错误
- (near JP17) 此定义从上往下看
- (in symbol SN74LVC1G14) NOT

### Library data of the parts
C110-C113 = C: 无极性贴片电容
  C110 C112: Voltage: 50v; Value: 100nf
  C111: Voltage: 50v; Value: 10nf
  C113: Voltage: 16v; Value: 1uf
IC25 = SN74LVC1G14: 单路施密特触发反向器
JP17 = Header 12X2: 12*2P接插件
R102-R110 = R: 贴片电阻
  R102 R103: Value: 4.7k 0.1% 25ppm
  R104-R110: Value: 10k
U2 = SN74HC365D: 6路缓冲器

## Nets that join several sheets
ACC_IN: VESC_KS75600_ana_con (JP6.4), VESC_KS75600_power (R64.2)
ANA_BRK_S: VESC_KS75600_ana_con (R50.1), VESC_KS75600_motor_mcu (U1.27)
ANA_THR_S: VESC_KS75600_ana_con (R61.1), VESC_KS75600_motor_mcu (U1.26)
BRIDGE_ERR: VESC_KS75600_motor_mcu (U1.4), VESC_KS75600_mos_driver_conn (C111.1 IC25.1 IC25.2 R103.2)
BRK_BUF: VESC_KS75600_ana_con (8 pins), VESC_KS75600_motor_mcu (U1.33)
BUT_CC_S: VESC_KS75600_ana_con (C38.2 R24.1), VESC_KS75600_motor_mcu (R93.2)
BUT_REV_S: VESC_KS75600_ana_con (C39.2 R22.1), VESC_KS75600_motor_mcu (R95.2)
CAN_RX: VESC_KS75600_ana_con (IC5.4), VESC_KS75600_motor_mcu (U1.61)
CAN_TX: VESC_KS75600_ana_con (IC5.1), VESC_KS75600_motor_mcu (U1.62)
CUR_FILTER_SEL: VESC_KS75600_ana_con (IC3.4 IC8.4 IC11.4), VESC_KS75600_motor_mcu (U1.53)
GATE_EN: VESC_KS75600_motor_mcu (U1.3), VESC_KS75600_mos_driver_conn (U2.1)
GND: VESC_KS75600_ana_con (119 pins), VESC_KS75600_power (53 pins), VESC_KS75600_motor_mcu (33 pins), VESC_KS75600_mos_driver_conn (16 pins)
HALL_A_S: VESC_KS75600_ana_con (R42.1), VESC_KS75600_motor_mcu (U1.37)
HALL_B_S: VESC_KS75600_ana_con (R45.1), VESC_KS75600_motor_mcu (U1.38)
HALL_C_S: VESC_KS75600_ana_con (R46.1), VESC_KS75600_motor_mcu (U1.39)
HV_BUF: VESC_KS75600_ana_con (R36.1), VESC_KS75600_motor_mcu (U1.11)
IU_BUF: VESC_KS75600_ana_con (5 pins), VESC_KS75600_motor_mcu (U1.8)
IV_BUF: VESC_KS75600_ana_con (5 pins), VESC_KS75600_motor_mcu (U1.9)
IW_BUF: VESC_KS75600_ana_con (5 pins), VESC_KS75600_motor_mcu (U1.10)
MCU_RESET: VESC_KS75600_ana_con (JP5.5), VESC_KS75600_motor_mcu (C109.2 U1.7)
MOTOR_PWM_S: VESC_KS75600_ana_con (R47.1), VESC_KS75600_motor_mcu (U1.59)
NTC_DRV: VESC_KS75600_motor_mcu (U1.17), VESC_KS75600_mos_driver_conn (C113.2 JP17.9 R104.2)
NTC_MOTOR_S: VESC_KS75600_ana_con (IC9.1 IC9.4), VESC_KS75600_motor_mcu (U1.24)
PHA_FILTER_SEL: VESC_KS75600_ana_con (IC13.4 IC16.4 IC18.4), VESC_KS75600_motor_mcu (U1.40)
S_HU: VESC_KS75600_motor_mcu (U1.41), VESC_KS75600_mos_driver_conn (U2.2)
S_HV: VESC_KS75600_motor_mcu (U1.42), VESC_KS75600_mos_driver_conn (U2.4)
S_HW: VESC_KS75600_motor_mcu (U1.43), VESC_KS75600_mos_driver_conn (U2.6)
S_LU: VESC_KS75600_motor_mcu (U1.34), VESC_KS75600_mos_driver_conn (U2.10)
S_LV: VESC_KS75600_motor_mcu (U1.35), VESC_KS75600_mos_driver_conn (U2.12)
S_LW: VESC_KS75600_motor_mcu (U1.36), VESC_KS75600_mos_driver_conn (U2.14)
SERVO_S: VESC_KS75600_ana_con (C37.2 R26.1), VESC_KS75600_motor_mcu (U1.58)
SPI_MISO: VESC_KS75600_ana_con (JP4.4), VESC_KS75600_motor_mcu (U1.22)
SPI_MOSI: VESC_KS75600_ana_con (JP4.5), VESC_KS75600_motor_mcu (U1.23)
SPI_NSS: VESC_KS75600_ana_con (JP4.2), VESC_KS75600_motor_mcu (U1.20)
SPI_SCK: VESC_KS75600_ana_con (JP4.3), VESC_KS75600_motor_mcu (U1.21)
SWCLK: VESC_KS75600_ana_con (JP5.2), VESC_KS75600_motor_mcu (U1.49)
SWDIO: VESC_KS75600_ana_con (JP5.3), VESC_KS75600_motor_mcu (U1.46)
VCC12: VESC_KS75600_power (9 pins), VESC_KS75600_mos_driver_conn (JP17.1 JP17.2 JP17.11 JP17.12)
VCC120: VESC_KS75600_ana_con (R2.1 R30.2), VESC_KS75600_power (21 pins)
VCCANA5: VESC_KS75600_ana_con (46 pins), VESC_KS75600_power (C85.2 C86.1 C87.1 V3.3)
VCCDIG5: VESC_KS75600_ana_con (10 pins), VESC_KS75600_power (7 pins), VESC_KS75600_motor_mcu (B2.1 R111.1), VESC_KS75600_mos_driver_conn (5 pins)
VCCMCU3V3: VESC_KS75600_ana_con (10 pins), VESC_KS75600_power (C81.1 C82.1 V2.2), VESC_KS75600_motor_mcu (20 pins), VESC_KS75600_mos_driver_conn (R104.1)
VU_BUF: VESC_KS75600_ana_con (R40.1), VESC_KS75600_motor_mcu (U1.14)
VV_BUF: VESC_KS75600_ana_con (R54.1), VESC_KS75600_motor_mcu (U1.15)
VW_BUF: VESC_KS75600_ana_con (R60.1), VESC_KS75600_motor_mcu (U1.16)